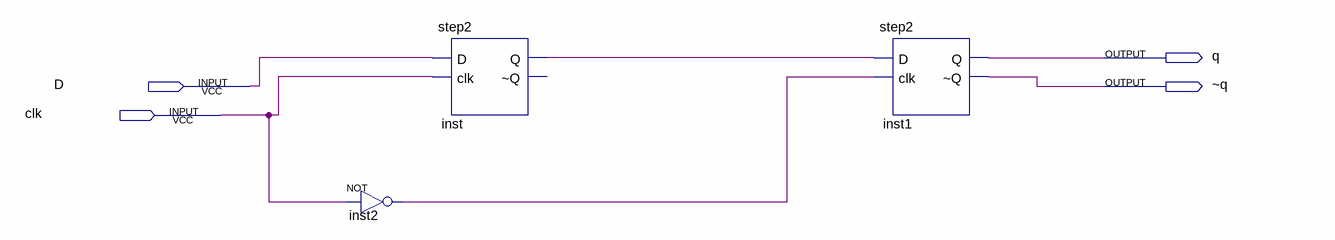
[diagram p0: schematic sheet]
// Quartus schematic step3.bdf as structural Verilog: 3 symbols, 4 pins
module step3 (
  input  D,
  input  clk,
  output q,
  output \~q 
);

  wire inst2_out, inst_q;

  not inst2 (inst2_out, clk);
  step2 inst (.D(D), .clk(clk), .Q(inst_q));  // open: ~Q
  step2 inst1 (.D(inst_q), .clk(inst2_out), .Q(q), .\~Q (\~q ));
endmodule
